# Altium schematic sheet BNO055imuModule.SchDoc
size A; SheetNumber: 8; SheetTotal: 12
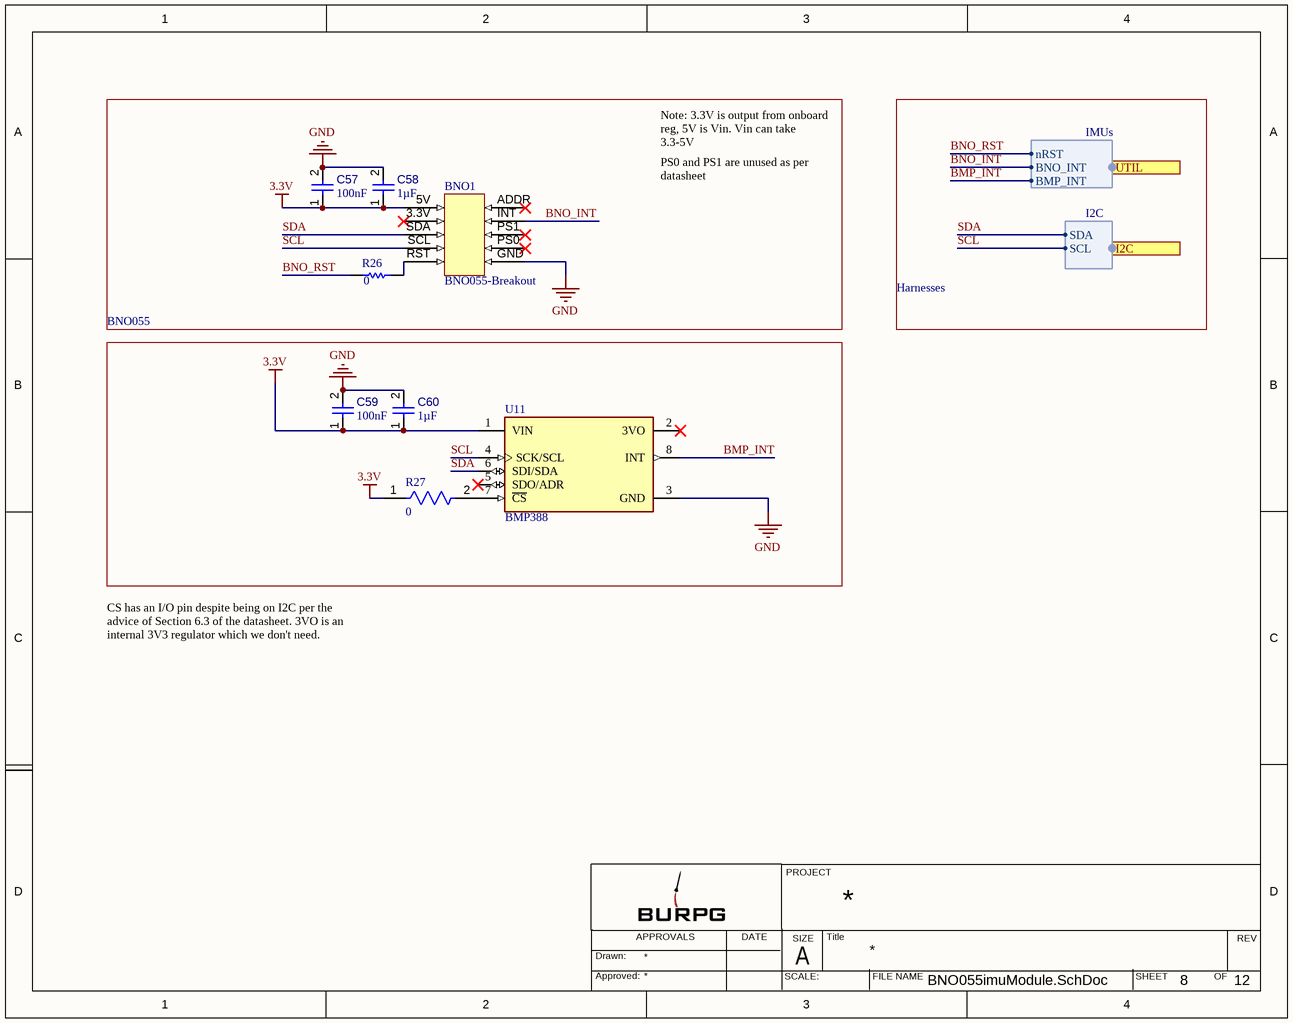
[diagram p0: BNO055imuModule.SchDoc]

## Parts
BNO1  BNO055-Breakout  [2472-Footprint-1]
C57  value 100nF  [CAPC2013X95X50LL10T25]  (hidden comment: Capacitor 100 nF +/-10% 50 V 0805)
C58  value 1µF  [CAPC2013X135X45NL10T25]  (hidden comment: Capacitor 1 uF +/- 10% 50 V 0805)
C59  value 100nF  [CAPC2013X95X50LL10T25]  (hidden comment: Capacitor 100 nF +/-10% 50 V 0805)
C60  value 1µF  [CAPC2013X135X45NL10T25]  (hidden comment: Capacitor 1 uF +/- 10% 50 V 0805)
R26  value 0  [RESC3116X70X50ML13T20]  (hidden comment: Resistor 0R +/- 0.05% 1206 250 mW)
R27  0  [FP-CRCW1206-e3-MFG]
U11  BMP388  [FP-3966-MFG]

## Blocks framed on the sheet
BNO055: BNO1 C57 C58 R26

## Ports
I2C (harness I2C), UTIL (harness IMUs)

## Harnesses
IMUs: nRST, BNO_INT, BMP_INT
I2C: SDA, SCL

## Nets
3.3V: BNO1.5V C57.1 C58.1 C59.1 C60.1 R27.1 U11.1(VIN)
GND: BNO1.GND C57.2 C58.2 C59.2 C60.2 U11.3(GND)
BMP_INT: U11.8(INT) ; port UTIL.BMP_INT
BNO_INT: BNO1.INT ; port UTIL.BNO_INT
BNO_RST: R26.1 ; port UTIL.nRST
SCL: BNO1.SCL U11.4(SCK/SCL) ; port I2C.SCL
SDA: BNO1.SDA U11.6(SDI/SDA) ; port I2C.SDA
NetBNO1_RST: BNO1.RST R26.2
NetR27_2: R27.2 U11.7(~{CS})

Not connected (* = marked no-connect by the designer): BNO1 3.3V* ADDR* PS0* PS1*; U11 2(3VO)* 5(SDO/ADR)*

## Notes on the sheet
- Note: 3.3V is output from onboard reg, 5V is Vin. Vin can take 3.3-5V
- PS0 and PS1 are unused as per datasheet
- Harnesses
- CS has an I/O pin despite being on I2C per the advice of Section 6.3 of the datasheet. 3VO is an internal 3V3 regulator which we don't need.
- PROJECT
- Drawn:
- Approved:
- APPROVALS
- DATE
- SCALE:
- SIZE
- A
- Title
- FILE NAME
- SHEET
- OF
- REV

## Library data of the parts
BNO1 = CMP-031-00006-1: Adafruit 9-Dof Absolute Orientation Imu Fusion Breakout - Bno055 Rohs Compliant: Yes
C57 C59 = CMP-001-00018-6: Chip Capacitor, 100 nF, +/- 10%, 50 V, 0805 (2012 Metric); Capacitor Type: Ceramic; Voltage Rating: 50V; Case/Package: 0805; Max Operating Temperature: 125°C; Min Operating Temperature: -55°C; Mounting Technology: SM; Pins: 2; RoHS Compliant: True; Tolerance: 10%
C58 C60 = CMP-001-00007-6: Chip Capacitor, 1 uF, +/- 10%, 50 V, 0805 (2012 Metric); Capacitor Type: Ceramic; Voltage Rating: 50V; Case/Package: 0805; Max Operating Temperature: 125°C; Min Operating Temperature: -55°C; Mounting Technology: SM; Pins: 2; RoHS Compliant: True; Tolerance: 10%
R26 = CMP-009-00008-5: Chip Resistor, 0 Ohm, 0.25 W, -55 to 155 degC, 1206 (3216 Metric); Voltage Rating: 200V; Power: 250mW; Pins: 2; Min Operating Temperature: -55°C; Tolerance: 0.05%; RoHS Compliant: True; Max Operating Temperature: 155°C; Mounting Technology: SM; Case/Package: 1206
R27 = CMP-2003-04797-2: RES Thick Film, 0Ω, 0.25W, 1206; Voltage Rating: 200V; Power Rating: 250mW; Resistance: 0mR; Depth: 1.6mm; Case/Package: 1206; Termination: SMD/SMT; Military Standard: Not; Length: 3.2mm; Height: 0.024inch; Number of Terminations: 2; Case Code (Metric): 3216; Width: 0.063inch; Features: Automotive AEC-Q200; Max Operating Temperature: 155°C; Min Operating Temperature: -55°C; Voltage Rating (DC): 200V; Contact Plating: Tin; Max Power Dissipation: 250mW; Radiation Hardening: No; Packaging: Tape and Reel; Package Quantity: 10000; Composition: Thick Film; Weight: 0.000353oz; Case Code (Imperial): 1206; Lead Free: Lead Free
U11 = CMP-144239-000001-1: BMP388 - PRECISION BAROMETRIC PR